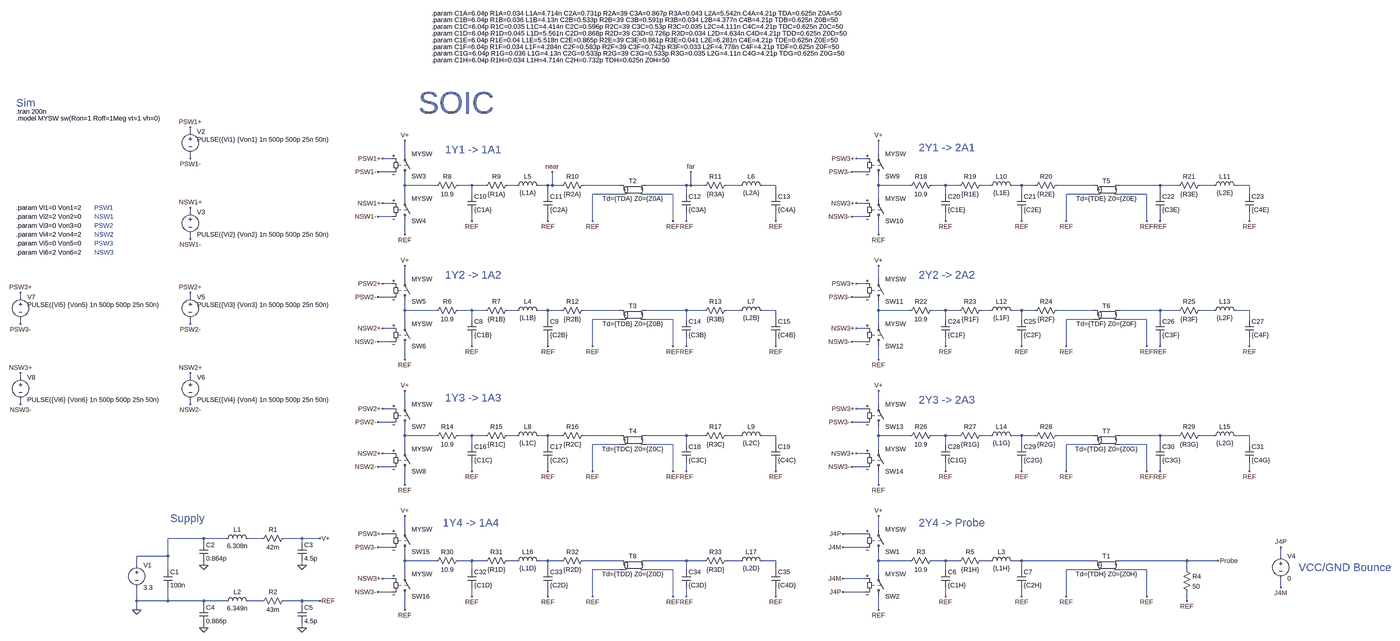
[diagram p0: schematic soic_model.asc, whole sheet]
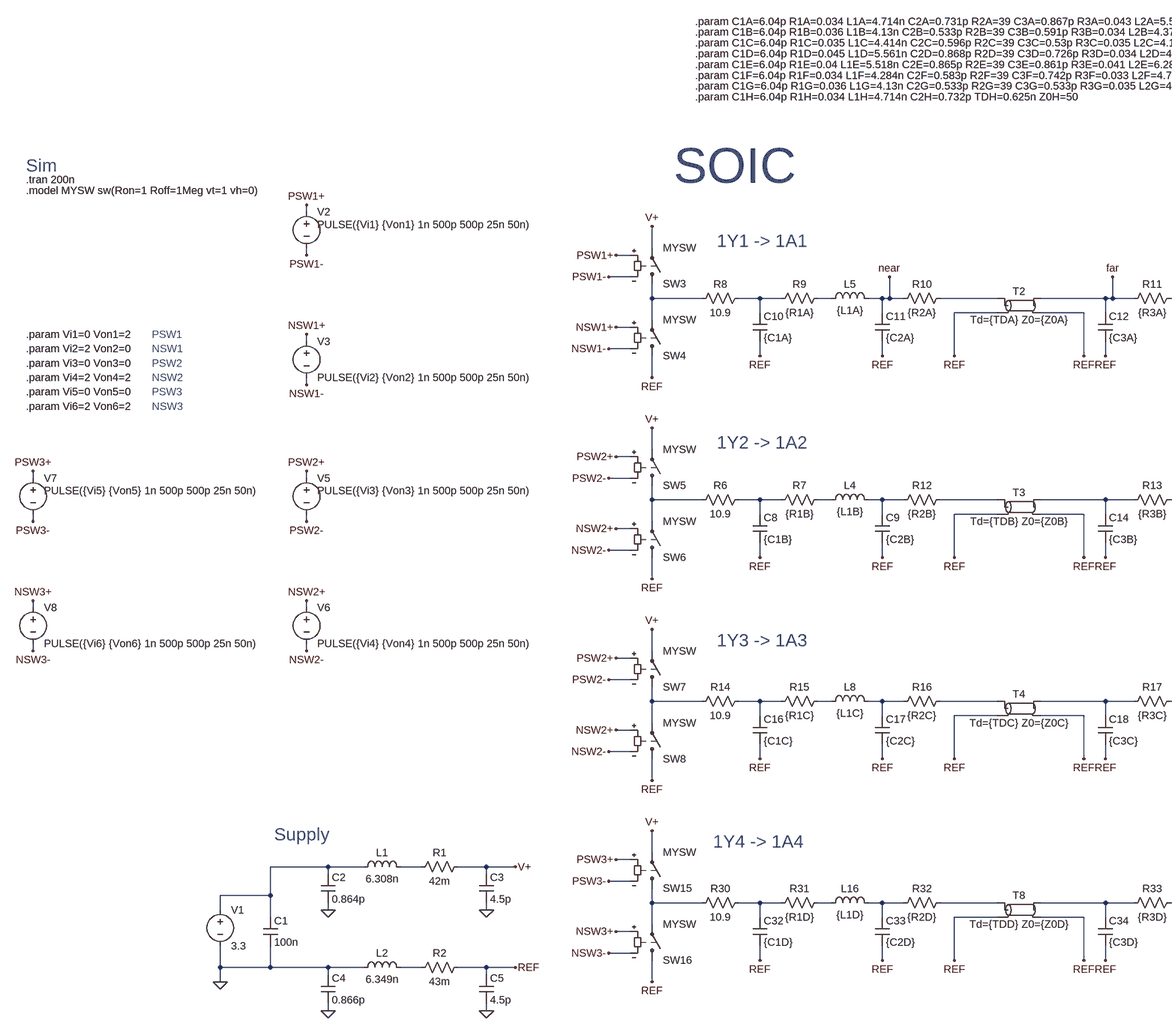
[diagram p1: schematic soic_model.asc, part, row 1 of 1, column 1 of 2]
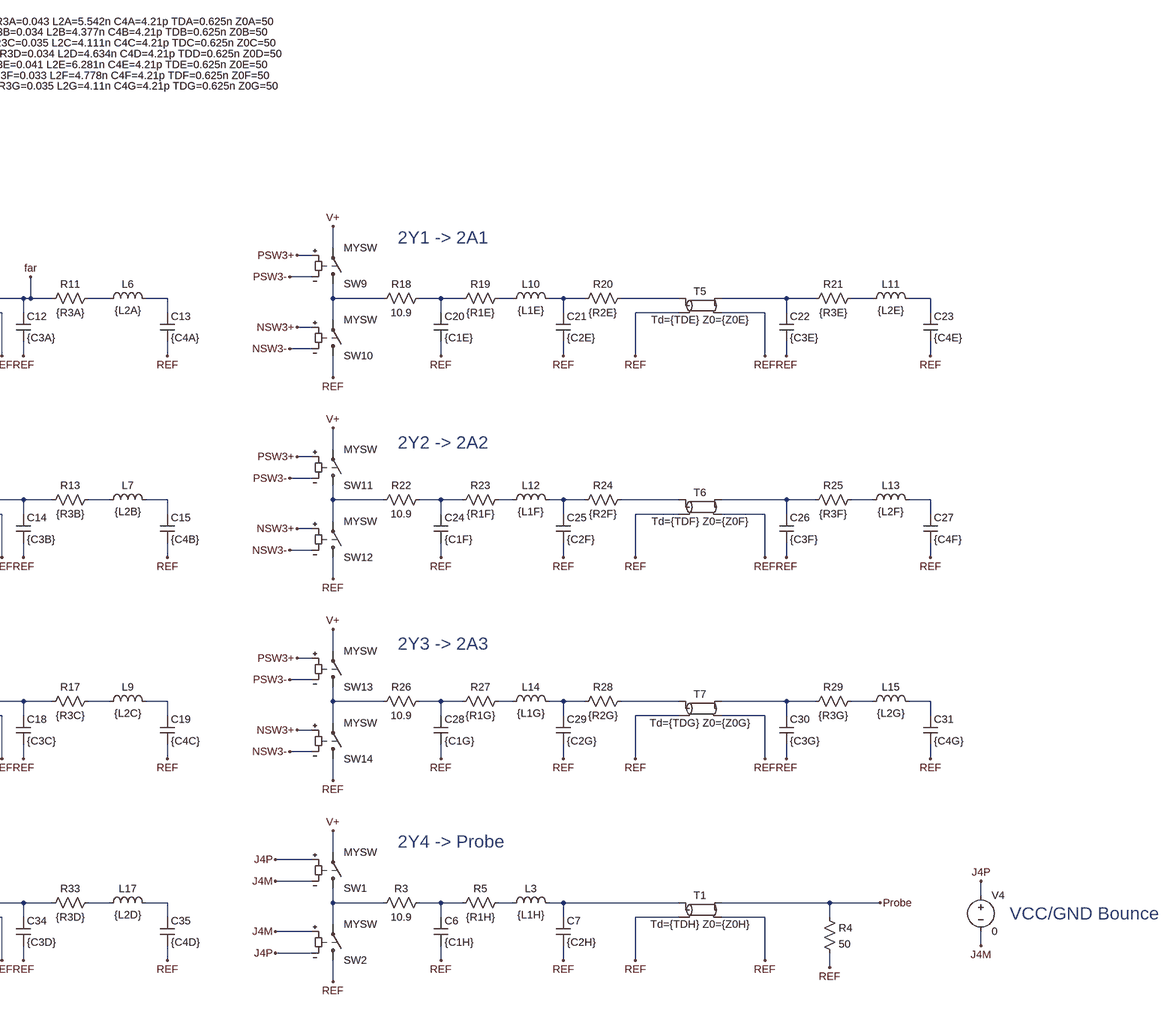
[diagram p2: schematic soic_model.asc, part, row 1 of 1, column 2 of 2]
soic_model.asc, the LTspice schematic file:
Version 4
SHEET 1 4716 1368
WIRE 336 -1072 336 -1088
WIRE 1104 -992 1104 -1040
WIRE 2800 -992 2800 -1040
WIRE 336 -976 336 -992
WIRE 1056 -976 1024 -976
WIRE 2752 -976 2720 -976
WIRE 1056 -928 1008 -928
WIRE 2752 -928 2704 -928
WIRE 1104 -880 1104 -912
WIRE 1216 -880 1104 -880
WIRE 1344 -880 1296 -880
WIRE 1392 -880 1344 -880
WIRE 1504 -880 1472 -880
WIRE 1616 -880 1584 -880
WIRE 1632 -880 1632 -928
WIRE 1632 -880 1616 -880
WIRE 1664 -880 1632 -880
WIRE 1872 -880 1744 -880
WIRE 2112 -880 1968 -880
WIRE 2128 -880 2128 -928
WIRE 2128 -880 2112 -880
WIRE 2176 -880 2128 -880
WIRE 2304 -880 2256 -880
WIRE 2432 -880 2384 -880
WIRE 2800 -880 2800 -912
WIRE 2912 -880 2800 -880
WIRE 3040 -880 2992 -880
WIRE 3088 -880 3040 -880
WIRE 3200 -880 3168 -880
WIRE 3312 -880 3280 -880
WIRE 3360 -880 3312 -880
WIRE 3568 -880 3440 -880
WIRE 3808 -880 3664 -880
WIRE 3872 -880 3808 -880
WIRE 4000 -880 3952 -880
WIRE 4128 -880 4080 -880
WIRE 1344 -848 1344 -880
WIRE 1616 -848 1616 -880
WIRE 1872 -848 1776 -848
WIRE 2064 -848 1968 -848
WIRE 2112 -848 2112 -880
WIRE 2432 -848 2432 -880
WIRE 3040 -848 3040 -880
WIRE 3312 -848 3312 -880
WIRE 3568 -848 3472 -848
WIRE 3760 -848 3664 -848
WIRE 3808 -848 3808 -880
WIRE 4128 -848 4128 -880
WIRE 1104 -832 1104 -880
WIRE 2800 -832 2800 -880
WIRE 1056 -816 1024 -816
WIRE 2752 -816 2720 -816
WIRE 336 -784 336 -800
WIRE 1056 -768 1008 -768
WIRE 2752 -768 2704 -768
WIRE 1344 -752 1344 -784
WIRE 1616 -752 1616 -784
WIRE 1776 -752 1776 -848
WIRE 2064 -752 2064 -848
WIRE 2112 -752 2112 -784
WIRE 2432 -752 2432 -784
WIRE 3040 -752 3040 -784
WIRE 3312 -752 3312 -784
WIRE 3472 -752 3472 -848
WIRE 3760 -752 3760 -848
WIRE 3808 -752 3808 -784
WIRE 4128 -752 4128 -784
WIRE 1104 -704 1104 -752
WIRE 2800 -704 2800 -752
WIRE 336 -688 336 -704
WIRE 1104 -544 1104 -592
WIRE 2800 -544 2800 -592
WIRE 1056 -528 1024 -528
WIRE 2752 -528 2720 -528
WIRE -272 -480 -272 -496
WIRE 336 -480 336 -496
WIRE 1056 -480 1008 -480
WIRE 2752 -480 2704 -480
WIRE 1104 -432 1104 -464
WIRE 1216 -432 1104 -432
WIRE 1344 -432 1296 -432
WIRE 1392 -432 1344 -432
WIRE 1504 -432 1472 -432
WIRE 1616 -432 1584 -432
WIRE 1664 -432 1616 -432
WIRE 1872 -432 1744 -432
WIRE 2112 -432 1968 -432
WIRE 2176 -432 2112 -432
WIRE 2304 -432 2256 -432
WIRE 2432 -432 2384 -432
WIRE 2800 -432 2800 -464
WIRE 2912 -432 2800 -432
WIRE 3040 -432 2992 -432
WIRE 3088 -432 3040 -432
WIRE 3200 -432 3168 -432
WIRE 3312 -432 3280 -432
WIRE 3360 -432 3312 -432
WIRE 3568 -432 3440 -432
WIRE 3808 -432 3664 -432
WIRE 3872 -432 3808 -432
WIRE 4000 -432 3952 -432
WIRE 4128 -432 4080 -432
WIRE 1344 -400 1344 -432
WIRE 1616 -400 1616 -432
WIRE 1872 -400 1776 -400
WIRE 2064 -400 1968 -400
WIRE 2112 -400 2112 -432
WIRE 2432 -400 2432 -432
WIRE 3040 -400 3040 -432
WIRE 3312 -400 3312 -432
WIRE 3568 -400 3472 -400
WIRE 3760 -400 3664 -400
WIRE 3808 -400 3808 -432
WIRE 4128 -400 4128 -432
WIRE -272 -384 -272 -400
WIRE 336 -384 336 -400
WIRE 1104 -384 1104 -432
WIRE 2800 -384 2800 -432
WIRE 1056 -368 1024 -368
WIRE 2752 -368 2720 -368
WIRE 1056 -320 1008 -320
WIRE 2752 -320 2704 -320
WIRE 1344 -304 1344 -336
WIRE 1616 -304 1616 -336
WIRE 1776 -304 1776 -400
WIRE 2064 -304 2064 -400
WIRE 2112 -304 2112 -336
WIRE 2432 -304 2432 -336
WIRE 3040 -304 3040 -336
WIRE 3312 -304 3312 -336
WIRE 3472 -304 3472 -400
WIRE 3760 -304 3760 -400
WIRE 3808 -304 3808 -336
WIRE 4128 -304 4128 -336
WIRE 1104 -256 1104 -304
WIRE 2800 -256 2800 -304
WIRE -272 -192 -272 -208
WIRE 336 -192 336 -208
WIRE -272 -96 -272 -112
WIRE 336 -96 336 -112
WIRE 1104 -96 1104 -144
WIRE 2800 -96 2800 -144
WIRE 1056 -80 1024 -80
WIRE 2752 -80 2720 -80
WIRE 1056 -32 1008 -32
WIRE 2752 -32 2704 -32
WIRE 1104 16 1104 -16
WIRE 1216 16 1104 16
WIRE 1344 16 1296 16
WIRE 1392 16 1344 16
WIRE 1504 16 1472 16
WIRE 1616 16 1584 16
WIRE 1664 16 1616 16
WIRE 1872 16 1744 16
WIRE 2112 16 1968 16
WIRE 2176 16 2112 16
WIRE 2304 16 2256 16
WIRE 2432 16 2384 16
WIRE 2800 16 2800 -16
WIRE 2912 16 2800 16
WIRE 3040 16 2992 16
WIRE 3088 16 3040 16
WIRE 3200 16 3168 16
WIRE 3312 16 3280 16
WIRE 3360 16 3312 16
WIRE 3568 16 3440 16
WIRE 3808 16 3664 16
WIRE 3872 16 3808 16
WIRE 4000 16 3952 16
WIRE 4128 16 4080 16
WIRE 1344 48 1344 16
WIRE 1616 48 1616 16
WIRE 1872 48 1776 48
WIRE 2064 48 1968 48
WIRE 2112 48 2112 16
WIRE 2432 48 2432 16
WIRE 3040 48 3040 16
WIRE 3312 48 3312 16
WIRE 3568 48 3472 48
WIRE 3760 48 3664 48
WIRE 3808 48 3808 16
WIRE 4128 48 4128 16
WIRE 1104 64 1104 16
WIRE 2800 64 2800 16
WIRE 1056 80 1024 80
WIRE 2752 80 2720 80
WIRE 1056 128 1008 128
WIRE 2752 128 2704 128
WIRE 1344 144 1344 112
WIRE 1616 144 1616 112
WIRE 1776 144 1776 48
WIRE 2064 144 2064 48
WIRE 2112 144 2112 112
WIRE 2432 144 2432 112
WIRE 3040 144 3040 112
WIRE 3312 144 3312 112
WIRE 3472 144 3472 48
WIRE 3760 144 3760 48
WIRE 3808 144 3808 112
WIRE 4128 144 4128 112
WIRE 1104 192 1104 144
WIRE 2800 192 2800 144
WIRE 1104 352 1104 304
WIRE 2800 352 2800 304
WIRE 1056 368 1024 368
WIRE 2752 368 2672 368
WIRE 384 384 256 384
WIRE 464 384 384 384
WIRE 592 384 544 384
WIRE 736 384 672 384
WIRE 800 384 736 384
WIRE 384 400 384 384
WIRE 736 400 736 384
WIRE 1056 416 1008 416
WIRE 2752 416 2672 416
WIRE 256 448 256 384
WIRE 256 448 144 448
WIRE 4240 448 4240 416
WIRE 1104 464 1104 432
WIRE 1216 464 1104 464
WIRE 1344 464 1296 464
WIRE 1392 464 1344 464
WIRE 1504 464 1472 464
WIRE 1616 464 1584 464
WIRE 1664 464 1616 464
WIRE 1872 464 1744 464
WIRE 2112 464 1968 464
WIRE 2176 464 2112 464
WIRE 2304 464 2256 464
WIRE 2432 464 2384 464
WIRE 2800 464 2800 432
WIRE 2912 464 2800 464
WIRE 3040 464 2992 464
WIRE 3088 464 3040 464
WIRE 3200 464 3168 464
WIRE 3312 464 3280 464
WIRE 3568 464 3312 464
WIRE 3904 464 3664 464
WIRE 4016 464 3904 464
WIRE 144 480 144 448
WIRE 384 480 384 464
WIRE 736 480 736 464
WIRE 256 496 256 448
WIRE 1344 496 1344 464
WIRE 1616 496 1616 464
WIRE 1872 496 1776 496
WIRE 2064 496 1968 496
WIRE 2112 496 2112 464
WIRE 2432 496 2432 464
WIRE 3040 496 3040 464
WIRE 3312 496 3312 464
WIRE 3568 496 3472 496
WIRE 3760 496 3664 496
WIRE 3904 496 3904 464
WIRE 1104 512 1104 464
WIRE 2800 512 2800 464
WIRE 1056 528 1024 528
WIRE 2752 528 2672 528
WIRE 4240 560 4240 528
WIRE 1056 576 1008 576
WIRE 2752 576 2672 576
WIRE 1344 592 1344 560
WIRE 1616 592 1616 560
WIRE 1776 592 1776 496
WIRE 2064 592 2064 496
WIRE 2112 592 2112 560
WIRE 2432 592 2432 560
WIRE 3040 592 3040 560
WIRE 3312 592 3312 560
WIRE 3472 592 3472 496
WIRE 3760 592 3760 496
WIRE 144 608 144 560
WIRE 256 608 256 560
WIRE 256 608 144 608
WIRE 384 608 256 608
WIRE 464 608 384 608
WIRE 592 608 544 608
WIRE 736 608 672 608
WIRE 800 608 736 608
WIRE 3904 608 3904 576
WIRE 384 624 384 608
WIRE 736 624 736 608
WIRE 144 640 144 608
WIRE 1104 640 1104 592
WIRE 2800 640 2800 592
WIRE 384 704 384 688
WIRE 736 704 736 688
FLAG 144 640 0
FLAG 736 480 0
FLAG 384 480 0
FLAG 736 704 0
FLAG 384 704 0
FLAG 800 384 V+
FLAG 800 608 REF
FLAG 2800 304 V+
FLAG 2800 640 REF
FLAG 3040 592 REF
FLAG 3312 592 REF
FLAG 3760 592 REF
FLAG 3472 592 REF
FLAG 3904 608 REF
FLAG 1024 -976 PSW1+
FLAG 1008 -928 PSW1-
FLAG 1024 -816 NSW1+
FLAG 1008 -768 NSW1-
FLAG 1104 -1040 V+
FLAG 1104 -704 REF
FLAG 1344 -752 REF
FLAG 1616 -752 REF
FLAG 2112 -752 REF
FLAG 2432 -752 REF
FLAG 2064 -752 REF
FLAG 1776 -752 REF
FLAG 2672 416 J4M
FLAG 2672 368 J4P
FLAG 4240 560 J4M
FLAG 4240 416 J4P
FLAG 2672 576 J4P
FLAG 2672 528 J4M
FLAG 1024 -528 PSW2+
FLAG 1008 -480 PSW2-
FLAG 1024 -368 NSW2+
FLAG 1008 -320 NSW2-
FLAG 1104 -592 V+
FLAG 1104 -256 REF
FLAG 1344 -304 REF
FLAG 1616 -304 REF
FLAG 2112 -304 REF
FLAG 2432 -304 REF
FLAG 2064 -304 REF
FLAG 1776 -304 REF
FLAG 1024 -80 PSW2+
FLAG 1008 -32 PSW2-
FLAG 1024 80 NSW2+
FLAG 1008 128 NSW2-
FLAG 1104 -144 V+
FLAG 1104 192 REF
FLAG 1344 144 REF
FLAG 1616 144 REF
FLAG 2112 144 REF
FLAG 2432 144 REF
FLAG 2064 144 REF
FLAG 1776 144 REF
FLAG 2720 -976 PSW3+
FLAG 2704 -928 PSW3-
FLAG 2720 -816 NSW3+
FLAG 2704 -768 NSW3-
FLAG 2800 -1040 V+
FLAG 2800 -704 REF
FLAG 3040 -752 REF
FLAG 3312 -752 REF
FLAG 3808 -752 REF
FLAG 4128 -752 REF
FLAG 3760 -752 REF
FLAG 3472 -752 REF
FLAG 2720 -528 PSW3+
FLAG 2704 -480 PSW3-
FLAG 2720 -368 NSW3+
FLAG 2704 -320 NSW3-
FLAG 2800 -592 V+
FLAG 2800 -256 REF
FLAG 3040 -304 REF
FLAG 3312 -304 REF
FLAG 3808 -304 REF
FLAG 4128 -304 REF
FLAG 3760 -304 REF
FLAG 3472 -304 REF
FLAG 2720 -80 PSW3+
FLAG 2704 -32 PSW3-
FLAG 2720 80 NSW3+
FLAG 2704 128 NSW3-
FLAG 2800 -144 V+
FLAG 2800 192 REF
FLAG 3040 144 REF
FLAG 3312 144 REF
FLAG 3808 144 REF
FLAG 4128 144 REF
FLAG 3760 144 REF
FLAG 3472 144 REF
FLAG 1024 368 PSW3+
FLAG 1008 416 PSW3-
FLAG 1024 528 NSW3+
FLAG 1008 576 NSW3-
FLAG 1104 304 V+
FLAG 1104 640 REF
FLAG 1344 592 REF
FLAG 1616 592 REF
FLAG 2112 592 REF
FLAG 2432 592 REF
FLAG 2064 592 REF
FLAG 1776 592 REF
FLAG 4016 464 Probe
FLAG 336 -496 PSW2+
FLAG 336 -208 NSW2+
FLAG 336 -384 PSW2-
FLAG 336 -96 NSW2-
FLAG 336 -1088 PSW1+
FLAG 336 -800 NSW1+
FLAG 336 -976 PSW1-
FLAG 336 -688 NSW1-
FLAG -272 -496 PSW3+
FLAG -272 -208 NSW3+
FLAG -272 -384 PSW3-
FLAG -272 -96 NSW3-
FLAG 1632 -928 near
FLAG 2128 -928 far
SYMBOL voltage 144 464 R0
WINDOW 123 0 0 Left 0
WINDOW 39 0 0 Left 0
SYMATTR InstName V1
SYMATTR Value 3.3
SYMBOL cap 240 496 R0
SYMATTR InstName C1
SYMATTR Value 100n
SYMBOL cap 368 400 R0
SYMATTR InstName C2
SYMATTR Value 0.864p
SYMBOL ind 448 400 R270
WINDOW 0 32 56 VTop 2
WINDOW 3 5 56 VBottom 2
SYMATTR InstName L1
SYMATTR Value 6.308n
SYMBOL res 688 368 R90
WINDOW 0 0 56 VBottom 2
WINDOW 3 32 56 VTop 2
SYMATTR InstName R1
SYMATTR Value 42m
SYMBOL cap 720 400 R0
SYMATTR InstName C3
SYMATTR Value 4.5p
SYMBOL cap 368 624 R0
SYMATTR InstName C4
SYMATTR Value 0.866p
SYMBOL ind 448 624 R270
WINDOW 0 32 56 VTop 2
WINDOW 3 5 56 VBottom 2
SYMATTR InstName L2
SYMATTR Value 6.349n
SYMBOL res 688 592 R90
WINDOW 0 0 56 VBottom 2
WINDOW 3 32 56 VTop 2
SYMATTR InstName R2
SYMATTR Value 43m
SYMBOL cap 720 624 R0
SYMATTR InstName C5
SYMATTR Value 4.5p
SYMBOL sw 2800 448 M180
SYMATTR InstName SW1
SYMATTR Value MYSW
SYMBOL res 3008 448 R90
WINDOW 0 0 56 VBottom 2
WINDOW 3 32 56 VTop 2
SYMATTR InstName R3
SYMATTR Value 10.9
SYMBOL sw 2800 608 M180
SYMATTR InstName SW2
SYMATTR Value MYSW
SYMBOL cap 3024 496 R0
SYMATTR InstName C6
SYMATTR Value {C1H}
SYMBOL res 3184 448 R90
WINDOW 0 0 56 VBottom 2
WINDOW 3 32 56 VTop 2
SYMATTR InstName R5
SYMATTR Value {R1H}
SYMBOL ind 3184 480 R270
WINDOW 0 32 56 VTop 2
WINDOW 3 5 56 VBottom 2
SYMATTR InstName L3
SYMATTR Value {L1H}
SYMBOL tline 3616 480 R0
SYMATTR InstName T1
SYMATTR Value Td={TDH} Z0={Z0H}
SYMBOL cap 3296 496 R0
SYMATTR InstName C7
SYMATTR Value {C2H}
SYMBOL res 3888 480 R0
SYMATTR InstName R4
SYMATTR Value 50
SYMBOL sw 1104 -896 M180
SYMATTR InstName SW3
SYMATTR Value MYSW
SYMBOL res 1312 -896 R90
WINDOW 0 0 56 VBottom 2
WINDOW 3 32 56 VTop 2
SYMATTR InstName R8
SYMATTR Value 10.9
SYMBOL sw 1104 -736 M180
SYMATTR InstName SW4
SYMATTR Value MYSW
SYMBOL cap 1328 -848 R0
SYMATTR InstName C10
SYMATTR Value {C1A}
SYMBOL res 1488 -896 R90
WINDOW 0 0 56 VBottom 2
WINDOW 3 32 56 VTop 2
SYMATTR InstName R9
SYMATTR Value {R1A}
SYMBOL ind 1488 -864 R270
WINDOW 0 32 56 VTop 2
WINDOW 3 5 56 VBottom 2
SYMATTR InstName L5
SYMATTR Value {L1A}
SYMBOL res 1760 -896 R90
WINDOW 0 0 56 VBottom 2
WINDOW 3 32 56 VTop 2
SYMATTR InstName R10
SYMATTR Value {R2A}
SYMBOL tline 1920 -864 R0
SYMATTR InstName T2
SYMATTR Value Td={TDA} Z0={Z0A}
SYMBOL res 2272 -896 R90
WINDOW 0 0 56 VBottom 2
WINDOW 3 32 56 VTop 2
SYMATTR InstName R11
SYMATTR Value {R3A}
SYMBOL ind 2288 -864 R270
WINDOW 0 32 56 VTop 2
WINDOW 3 5 56 VBottom 2
SYMATTR InstName L6
SYMATTR Value {L2A}
SYMBOL cap 1600 -848 R0
SYMATTR InstName C11
SYMATTR Value {C2A}
SYMBOL cap 2096 -848 R0
SYMATTR InstName C12
SYMATTR Value {C3A}
SYMBOL cap 2416 -848 R0
SYMATTR InstName C13
SYMATTR Value {C4A}
SYMBOL voltage 4240 432 R0
WINDOW 123 0 0 Left 0
WINDOW 39 0 0 Left 0
SYMATTR InstName V4
SYMATTR Value 0
SYMBOL sw 1104 -448 M180
SYMATTR InstName SW5
SYMATTR Value MYSW
SYMBOL res 1312 -448 R90
WINDOW 0 0 56 VBottom 2
WINDOW 3 32 56 VTop 2
SYMATTR InstName R6
SYMATTR Value 10.9
SYMBOL sw 1104 -288 M180
SYMATTR InstName SW6
SYMATTR Value MYSW
SYMBOL cap 1328 -400 R0
SYMATTR InstName C8
SYMATTR Value {C1B}
SYMBOL res 1488 -448 R90
WINDOW 0 0 56 VBottom 2
WINDOW 3 32 56 VTop 2
SYMATTR InstName R7
SYMATTR Value {R1B}
SYMBOL ind 1488 -416 R270
WINDOW 0 32 56 VTop 2
WINDOW 3 5 56 VBottom 2
SYMATTR InstName L4
SYMATTR Value {L1B}
SYMBOL res 1760 -448 R90
WINDOW 0 0 56 VBottom 2
WINDOW 3 32 56 VTop 2
SYMATTR InstName R12
SYMATTR Value {R2B}
SYMBOL tline 1920 -416 R0
SYMATTR InstName T3
SYMATTR Value Td={TDB} Z0={Z0B}
SYMBOL res 2272 -448 R90
WINDOW 0 0 56 VBottom 2
WINDOW 3 32 56 VTop 2
SYMATTR InstName R13
SYMATTR Value {R3B}
SYMBOL ind 2288 -416 R270
WINDOW 0 32 56 VTop 2
WINDOW 3 5 56 VBottom 2
SYMATTR InstName L7
SYMATTR Value {L2B}
SYMBOL cap 1600 -400 R0
SYMATTR InstName C9
SYMATTR Value {C2B}
SYMBOL cap 2096 -400 R0
SYMATTR InstName C14
SYMATTR Value {C3B}
SYMBOL cap 2416 -400 R0
SYMATTR InstName C15
SYMATTR Value {C4B}
SYMBOL sw 1104 0 M180
SYMATTR InstName SW7
SYMATTR Value MYSW
SYMBOL res 1312 0 R90
WINDOW 0 0 56 VBottom 2
WINDOW 3 32 56 VTop 2
SYMATTR InstName R14
SYMATTR Value 10.9
SYMBOL sw 1104 160 M180
SYMATTR InstName SW8
SYMATTR Value MYSW
SYMBOL cap 1328 48 R0
SYMATTR InstName C16
SYMATTR Value {C1C}
SYMBOL res 1488 0 R90
WINDOW 0 0 56 VBottom 2
WINDOW 3 32 56 VTop 2
SYMATTR InstName R15
SYMATTR Value {R1C}
SYMBOL ind 1488 32 R270
WINDOW 0 32 56 VTop 2
WINDOW 3 5 56 VBottom 2
SYMATTR InstName L8
SYMATTR Value {L1C}
SYMBOL res 1760 0 R90
WINDOW 0 0 56 VBottom 2
WINDOW 3 32 56 VTop 2
SYMATTR InstName R16
SYMATTR Value {R2C}
SYMBOL tline 1920 32 R0
SYMATTR InstName T4
SYMATTR Value Td={TDC} Z0={Z0C}
SYMBOL res 2272 0 R90
WINDOW 0 0 56 VBottom 2
WINDOW 3 32 56 VTop 2
SYMATTR InstName R17
SYMATTR Value {R3C}
SYMBOL ind 2288 32 R270
WINDOW 0 32 56 VTop 2
WINDOW 3 5 56 VBottom 2
SYMATTR InstName L9
SYMATTR Value {L2C}
SYMBOL cap 1600 48 R0
SYMATTR InstName C17
SYMATTR Value {C2C}
SYMBOL cap 2096 48 R0
SYMATTR InstName C18
SYMATTR Value {C3C}
SYMBOL cap 2416 48 R0
SYMATTR InstName C19
SYMATTR Value {C4C}
SYMBOL sw 2800 -896 M180
SYMATTR InstName SW9
SYMATTR Value MYSW
SYMBOL res 3008 -896 R90
WINDOW 0 0 56 VBottom 2
WINDOW 3 32 56 VTop 2
SYMATTR InstName R18
SYMATTR Value 10.9
SYMBOL sw 2800 -736 M180
SYMATTR InstName SW10
SYMATTR Value MYSW
SYMBOL cap 3024 -848 R0
SYMATTR InstName C20
SYMATTR Value {C1E}
SYMBOL res 3184 -896 R90
WINDOW 0 0 56 VBottom 2
WINDOW 3 32 56 VTop 2
SYMATTR InstName R19
SYMATTR Value {R1E}
SYMBOL ind 3184 -864 R270
WINDOW 0 32 56 VTop 2
WINDOW 3 5 56 VBottom 2
SYMATTR InstName L10
SYMATTR Value {L1E}
SYMBOL res 3456 -896 R90
WINDOW 0 0 56 VBottom 2
WINDOW 3 32 56 VTop 2
SYMATTR InstName R20
SYMATTR Value {R2E}
SYMBOL tline 3616 -864 R0
SYMATTR InstName T5
SYMATTR Value Td={TDE} Z0={Z0E}
SYMBOL res 3968 -896 R90
WINDOW 0 0 56 VBottom 2
WINDOW 3 32 56 VTop 2
SYMATTR InstName R21
SYMATTR Value {R3E}
SYMBOL ind 3984 -864 R270
WINDOW 0 32 56 VTop 2
WINDOW 3 5 56 VBottom 2
SYMATTR InstName L11
SYMATTR Value {L2E}
SYMBOL cap 3296 -848 R0
SYMATTR InstName C21
SYMATTR Value {C2E}
SYMBOL cap 3792 -848 R0
SYMATTR InstName C22
SYMATTR Value {C3E}
SYMBOL cap 4112 -848 R0
SYMATTR InstName C23
SYMATTR Value {C4E}
SYMBOL sw 2800 -448 M180
SYMATTR InstName SW11
SYMATTR Value MYSW
SYMBOL res 3008 -448 R90
WINDOW 0 0 56 VBottom 2
WINDOW 3 32 56 VTop 2
SYMATTR InstName R22
SYMATTR Value 10.9
SYMBOL sw 2800 -288 M180
SYMATTR InstName SW12
SYMATTR Value MYSW
SYMBOL cap 3024 -400 R0
SYMATTR InstName C24
SYMATTR Value {C1F}
SYMBOL res 3184 -448 R90
WINDOW 0 0 56 VBottom 2
WINDOW 3 32 56 VTop 2
SYMATTR InstName R23
SYMATTR Value {R1F}
SYMBOL ind 3184 -416 R270
WINDOW 0 32 56 VTop 2
WINDOW 3 5 56 VBottom 2
SYMATTR InstName L12
SYMATTR Value {L1F}
SYMBOL res 3456 -448 R90
WINDOW 0 0 56 VBottom 2
WINDOW 3 32 56 VTop 2
SYMATTR InstName R24
SYMATTR Value {R2F}
SYMBOL tline 3616 -416 R0
SYMATTR InstName T6
SYMATTR Value Td={TDF} Z0={Z0F}
SYMBOL res 3968 -448 R90
WINDOW 0 0 56 VBottom 2
WINDOW 3 32 56 VTop 2
SYMATTR InstName R25
SYMATTR Value {R3F}
SYMBOL ind 3984 -416 R270
WINDOW 0 32 56 VTop 2
WINDOW 3 5 56 VBottom 2
SYMATTR InstName L13
SYMATTR Value {L2F}
SYMBOL cap 3296 -400 R0
SYMATTR InstName C25
SYMATTR Value {C2F}
SYMBOL cap 3792 -400 R0
SYMATTR InstName C26
SYMATTR Value {C3F}
SYMBOL cap 4112 -400 R0
SYMATTR InstName C27
SYMATTR Value {C4F}
SYMBOL sw 2800 0 M180
SYMATTR InstName SW13
SYMATTR Value MYSW
SYMBOL res 3008 0 R90
WINDOW 0 0 56 VBottom 2
WINDOW 3 32 56 VTop 2
SYMATTR InstName R26
SYMATTR Value 10.9
SYMBOL sw 2800 160 M180
SYMATTR InstName SW14
SYMATTR Value MYSW
SYMBOL cap 3024 48 R0
SYMATTR InstName C28
SYMATTR Value {C1G}
SYMBOL res 3184 0 R90
WINDOW 0 0 56 VBottom 2
WINDOW 3 32 56 VTop 2
SYMATTR InstName R27
SYMATTR Value {R1G}
SYMBOL ind 3184 32 R270
WINDOW 0 32 56 VTop 2
WINDOW 3 5 56 VBottom 2
SYMATTR InstName L14
SYMATTR Value {L1G}
SYMBOL res 3456 0 R90
WINDOW 0 0 56 VBottom 2
WINDOW 3 32 56 VTop 2
SYMATTR InstName R28
SYMATTR Value {R2G}
SYMBOL tline 3616 32 R0
SYMATTR InstName T7
SYMATTR Value Td={TDG} Z0={Z0G}
SYMBOL res 3968 0 R90
WINDOW 0 0 56 VBottom 2
WINDOW 3 32 56 VTop 2
SYMATTR InstName R29
SYMATTR Value {R3G}
SYMBOL ind 3984 32 R270
WINDOW 0 32 56 VTop 2
WINDOW 3 5 56 VBottom 2
SYMATTR InstName L15
SYMATTR Value {L2G}
SYMBOL cap 3296 48 R0
SYMATTR InstName C29
SYMATTR Value {C2G}
SYMBOL cap 3792 48 R0
SYMATTR InstName C30
SYMATTR Value {C3G}
SYMBOL cap 4112 48 R0
SYMATTR InstName C31
SYMATTR Value {C4G}
SYMBOL sw 1104 448 M180
SYMATTR InstName SW15
SYMATTR Value MYSW
SYMBOL res 1312 448 R90
WINDOW 0 0 56 VBottom 2
WINDOW 3 32 56 VTop 2
SYMATTR InstName R30
SYMATTR Value 10.9
SYMBOL sw 1104 608 M180
SYMATTR InstName SW16
SYMATTR Value MYSW
SYMBOL cap 1328 496 R0
SYMATTR InstName C32
SYMATTR Value {C1D}
SYMBOL res 1488 448 R90
WINDOW 0 0 56 VBottom 2
WINDOW 3 32 56 VTop 2
SYMATTR InstName R31
SYMATTR Value {R1D}
SYMBOL ind 1488 480 R270
WINDOW 0 32 56 VTop 2
WINDOW 3 5 56 VBottom 2
SYMATTR InstName L16
SYMATTR Value {L1D}
SYMBOL res 1760 448 R90
WINDOW 0 0 56 VBottom 2
WINDOW 3 32 56 VTop 2
SYMATTR InstName R32
SYMATTR Value {R2D}
SYMBOL tline 1920 480 R0
SYMATTR InstName T8
SYMATTR Value Td={TDD} Z0={Z0D}
SYMBOL res 2272 448 R90
WINDOW 0 0 56 VBottom 2
WINDOW 3 32 56 VTop 2
SYMATTR InstName R33
SYMATTR Value {R3D}
SYMBOL ind 2288 480 R270
WINDOW 0 32 56 VTop 2
WINDOW 3 5 56 VBottom 2
SYMATTR InstName L17
SYMATTR Value {L2D}
SYMBOL cap 1600 496 R0
SYMATTR InstName C33
SYMATTR Value {C2D}
SYMBOL cap 2096 496 R0
SYMATTR InstName C34
SYMATTR Value {C3D}
SYMBOL cap 2416 496 R0
SYMATTR InstName C35
SYMATTR Value {C4D}
SYMBOL voltage 336 -496 R0
WINDOW 123 0 0 Left 0
WINDOW 39 0 0 Left 0
WINDOW 3 24 44 Left 2
SYMATTR Value PULSE({Vi3} {Von3} 1n 500p 500p 25n 50n)
SYMATTR InstName V5
SYMBOL voltage 336 -208 R0
WINDOW 123 0 0 Left 0
WINDOW 39 0 0 Left 0
SYMATTR InstName V6
SYMATTR Value PULSE({Vi4} {Von4} 1n 500p 500p 25n 50n)
SYMBOL voltage 336 -1088 R0
WINDOW 123 0 0 Left 0
WINDOW 39 0 0 Left 0
WINDOW 3 24 44 Left 2
SYMATTR Value PULSE({Vi1} {Von1} 1n 500p 500p 25n 50n)
SYMATTR InstName V2
SYMBOL voltage 336 -800 R0
WINDOW 123 0 0 Left 0
WINDOW 39 0 0 Left 0
SYMATTR InstName V3
SYMATTR Value PULSE({Vi2} {Von2} 1n 500p 500p 25n 50n)
SYMBOL voltage -272 -496 R0
WINDOW 123 0 0 Left 0
WINDOW 39 0 0 Left 0
WINDOW 3 24 44 Left 2
SYMATTR Value PULSE({Vi5} {Von5} 1n 500p 500p 25n 50n)
SYMATTR InstName V7
SYMBOL voltage -272 -208 R0
WINDOW 123 0 0 Left 0
WINDOW 39 0 0 Left 0
SYMATTR InstName V8
SYMATTR Value PULSE({Vi6} {Von6} 1n 500p 500p 25n 50n)
TEXT 1200 -1496 Left 2 !.param C1A=6.04p R1A=0.034 L1A=4.714n C2A=0.731p R2A=39 C3A=0.867p R3A=0.043 L2A=5.542n C4A=4.21p TDA=0.625n Z0A=50
TEXT -288 -1120 Left 2 !.model MYSW sw(Ron=1 Roff=1Meg vt=1 vh=0)
TEXT -288 -1144 Left 2 !.tran 200n
TEXT 1200 -1472 Left 2 !.param C1B=6.04p R1B=0.036 L1B=4.13n C2B=0.533p R2B=39 C3B=0.591p R3B=0.034 L2B=4.377n C4B=4.21p TDB=0.625n Z0B=50
TEXT 1200 -1448 Left 2 !.param C1C=6.04p R1C=0.035 L1C=4.414n C2C=0.596p R2C=39 C3C=0.53p R3C=0.035 L2C=4.111n C4C=4.21p TDC=0.625n Z0C=50
TEXT 1200 -1400 Left 2 !.param C1E=6.04p R1E=0.04 L1E=5.518n C2E=0.865p R2E=39 C3E=0.861p R3E=0.041 L2E=6.281n C4E=4.21p TDE=0.625n Z0E=50
TEXT 1200 -1376 Left 2 !.param C1F=6.04p R1F=0.034 L1F=4.284n C2F=0.583p R2F=39 C3F=0.742p R3F=0.033 L2F=4.778n C4F=4.21p TDF=0.625n Z0F=50
TEXT 1200 -1352 Left 2 !.param C1G=6.04p R1G=0.036 L1G=4.13n C2G=0.533p R2G=39 C3G=0.533p R3G=0.035 L2G=4.11n C4G=4.21p TDG=0.625n Z0G=50
TEXT 1200 -1424 Left 2 !.param C1D=6.04p R1D=0.045 L1D=5.561n C2D=0.868p R2D=39 C3D=0.726p R3D=0.034 L2D=4.634n C4D=4.21p TDD=0.625n Z0D=50
TEXT 1248 -1008 Left 4 ;1Y1 -> 1A1
TEXT 1248 -560 Left 4 ;1Y2 -> 1A2
TEXT 1248 -120 Left 4 ;1Y3 -> 1A3
TEXT 1240 328 Left 4 ;1Y4 -> 1A4
TEXT 2944 -1016 Left 4 ;2Y1 -> 2A1
TEXT 2944 -560 Left 4 ;2Y2 -> 2A2
TEXT 2944 -112 Left 4 ;2Y3 -> 2A3
TEXT 2944 328 Left 4 ;2Y4 -> Probe
TEXT 264 312 Left 4 ;Supply
TEXT -288 -1176 Left 4 ;Sim
TEXT 4304 488 Left 4 ;VCC/GND Bounce
TEXT -288 -800 Left 2 !.param Vi1=0 Von1=2
TEXT -288 -768 Left 2 !.param Vi2=2 Von2=0
TEXT -288 -736 Left 2 !.param Vi3=0 Von3=0
TEXT 1200 -1328 Left 2 !.param C1H=6.04p R1H=0.034 L1H=4.714n C2H=0.732p TDH=0.625n Z0H=50
TEXT 1152 -1176 Left 7 ;SOIC
TEXT -288 -704 Left 2 !.param Vi4=2 Von4=2
TEXT -288 -672 Left 2 !.param Vi5=0 Von5=0
TEXT -288 -640 Left 2 !.param Vi6=2 Von6=2
TEXT -8 -800 Left 2 ;PSW1
TEXT -8 -768 Left 2 ;NSW1
TEXT -8 -736 Left 2 ;PSW2
TEXT -8 -704 Left 2 ;NSW2
TEXT -8 -672 Left 2 ;PSW3
TEXT -8 -640 Left 2 ;NSW3

The netlist it stands for:
* soic_model.asc
V1 N047 0 3.3
C1 N047 0 100n
C2 N047 0 0.864p
L1 N047 N048 6.308n
R1 V+ N048 42m
C3 V+ 0 4.5p
C4 0 0 0.866p
L2 0 N061 6.349n
R2 REF N061 43m
C5 REF 0 4.5p
SW1 N057 V+ J4P J4M MYSW
R3 N058 N057 10.9
SW2 REF N057 J4M J4P MYSW
C6 N058 REF {C1H}
R5 N059 N058 {R1H}
L3 N059 N060 {L1H}
T1 N060 REF Probe REF Td={TDH} Z0={Z0H}
C7 N060 REF {C2H}
R4 Probe REF 50
SW3 N001 V+ PSW1+ PSW1- MYSW
R8 N002 N001 10.9
SW4 REF N001 NSW1+ NSW1- MYSW
C10 N002 REF {C1A}
R9 N003 N002 {R1A}
L5 N003 near {L1A}
R10 N004 near {R2A}
T2 N004 REF far REF Td={TDA} Z0={Z0A}
R11 N005 far {R3A}
L6 N005 N006 {L2A}
C11 near REF {C2A}
C12 far REF {C3A}
C13 N006 REF {C4A}
V4 J4P J4M 0
SW5 N015 V+ PSW2+ PSW2- MYSW
R6 N016 N015 10.9
SW6 REF N015 NSW2+ NSW2- MYSW
C8 N016 REF {C1B}
R7 N017 N016 {R1B}
L4 N017 N018 {L1B}
R12 N019 N018 {R2B}
T3 N019 REF N020 REF Td={TDB} Z0={Z0B}
R13 N021 N020 {R3B}
L7 N021 N022 {L2B}
C9 N018 REF {C2B}
C14 N020 REF {C3B}
C15 N022 REF {C4B}
SW7 N031 V+ PSW2+ PSW2- MYSW
R14 N032 N031 10.9
SW8 REF N031 NSW2+ NSW2- MYSW
C16 N032 REF {C1C}
R15 N033 N032 {R1C}
L8 N033 N034 {L1C}
R16 N035 N034 {R2C}
T4 N035 REF N036 REF Td={TDC} Z0={Z0C}
R17 N037 N036 {R3C}
L9 N037 N038 {L2C}
C17 N034 REF {C2C}
C18 N036 REF {C3C}
C19 N038 REF {C4C}
SW9 N007 V+ PSW3+ PSW3- MYSW
R18 N008 N007 10.9
SW10 REF N007 NSW3+ NSW3- MYSW
C20 N008 REF {C1E}
R19 N009 N008 {R1E}
L10 N009 N010 {L1E}
R20 N011 N010 {R2E}
T5 N011 REF N012 REF Td={TDE} Z0={Z0E}
R21 N013 N012 {R3E}
L11 N013 N014 {L2E}
C21 N010 REF {C2E}
C22 N012 REF {C3E}
C23 N014 REF {C4E}
SW11 N023 V+ PSW3+ PSW3- MYSW
R22 N024 N023 10.9
SW12 REF N023 NSW3+ NSW3- MYSW
C24 N024 REF {C1F}
R23 N025 N024 {R1F}
L12 N025 N026 {L1F}
R24 N027 N026 {R2F}
T6 N027 REF N028 REF Td={TDF} Z0={Z0F}
R25 N029 N028 {R3F}
L13 N029 N030 {L2F}
C25 N026 REF {C2F}
C26 N028 REF {C3F}
C27 N030 REF {C4F}
SW13 N039 V+ PSW3+ PSW3- MYSW
R26 N040 N039 10.9
SW14 REF N039 NSW3+ NSW3- MYSW
C28 N040 REF {C1G}
R27 N041 N040 {R1G}
L14 N041 N042 {L1G}
R28 N043 N042 {R2G}
T7 N043 REF N044 REF Td={TDG} Z0={Z0G}
R29 N045 N044 {R3G}
L15 N045 N046 {L2G}
C29 N042 REF {C2G}
C30 N044 REF {C3G}
C31 N046 REF {C4G}
SW15 N049 V+ PSW3+ PSW3- MYSW
R30 N050 N049 10.9
SW16 REF N049 NSW3+ NSW3- MYSW
C32 N050 REF {C1D}
R31 N051 N050 {R1D}
L16 N051 N052 {L1D}
R32 N053 N052 {R2D}
T8 N053 REF N054 REF Td={TDD} Z0={Z0D}
R33 N055 N054 {R3D}
L17 N055 N056 {L2D}
C33 N052 REF {C2D}
C34 N054 REF {C3D}
C35 N056 REF {C4D}
V5 PSW2+ PSW2- PULSE({Vi3} {Von3} 1n 500p 500p 25n 50n)
V6 NSW2+ NSW2- PULSE({Vi4} {Von4} 1n 500p 500p 25n 50n)
V2 PSW1+ PSW1- PULSE({Vi1} {Von1} 1n 500p 500p 25n 50n)
V3 NSW1+ NSW1- PULSE({Vi2} {Von2} 1n 500p 500p 25n 50n)
V7 PSW3+ PSW3- PULSE({Vi5} {Von5} 1n 500p 500p 25n 50n)
V8 NSW3+ NSW3- PULSE({Vi6} {Von6} 1n 500p 500p 25n 50n)
.param C1A=6.04p R1A=0.034 L1A=4.714n C2A=0.731p R2A=39 C3A=0.867p R3A=0.043 L2A=5.542n C4A=4.21p TDA=0.625n Z0A=50
.model MYSW sw(Ron=1 Roff=1Meg vt=1 vh=0)
.tran 200n
.param C1B=6.04p R1B=0.036 L1B=4.13n C2B=0.533p R2B=39 C3B=0.591p R3B=0.034 L2B=4.377n C4B=4.21p TDB=0.625n Z0B=50
.param C1C=6.04p R1C=0.035 L1C=4.414n C2C=0.596p R2C=39 C3C=0.53p R3C=0.035 L2C=4.111n C4C=4.21p TDC=0.625n Z0C=50
.param C1E=6.04p R1E=0.04 L1E=5.518n C2E=0.865p R2E=39 C3E=0.861p R3E=0.041 L2E=6.281n C4E=4.21p TDE=0.625n Z0E=50
.param C1F=6.04p R1F=0.034 L1F=4.284n C2F=0.583p R2F=39 C3F=0.742p R3F=0.033 L2F=4.778n C4F=4.21p TDF=0.625n Z0F=50
.param C1G=6.04p R1G=0.036 L1G=4.13n C2G=0.533p R2G=39 C3G=0.533p R3G=0.035 L2G=4.11n C4G=4.21p TDG=0.625n Z0G=50
.param C1D=6.04p R1D=0.045 L1D=5.561n C2D=0.868p R2D=39 C3D=0.726p R3D=0.034 L2D=4.634n C4D=4.21p TDD=0.625n Z0D=50
* 1Y1 -> 1A1
* 1Y2 -> 1A2
* 1Y3 -> 1A3
* 1Y4 -> 1A4
* 2Y1 -> 2A1
* 2Y2 -> 2A2
* 2Y3 -> 2A3
* 2Y4 -> Probe
* Supply
* Sim
* VCC/GND Bounce
.param Vi1=0 Von1=2
.param Vi2=2 Von2=0
.param Vi3=0 Von3=0
.param C1H=6.04p R1H=0.034 L1H=4.714n C2H=0.732p TDH=0.625n Z0H=50
* SOIC
.param Vi4=2 Von4=2
.param Vi5=0 Von5=0
.param Vi6=2 Von6=2
* PSW1
* NSW1
* PSW2
* NSW2
* PSW3
* NSW3
.backanno
.end